# EAGLE design Carrier-Board-CM740 (EAGLE 9.6.2)
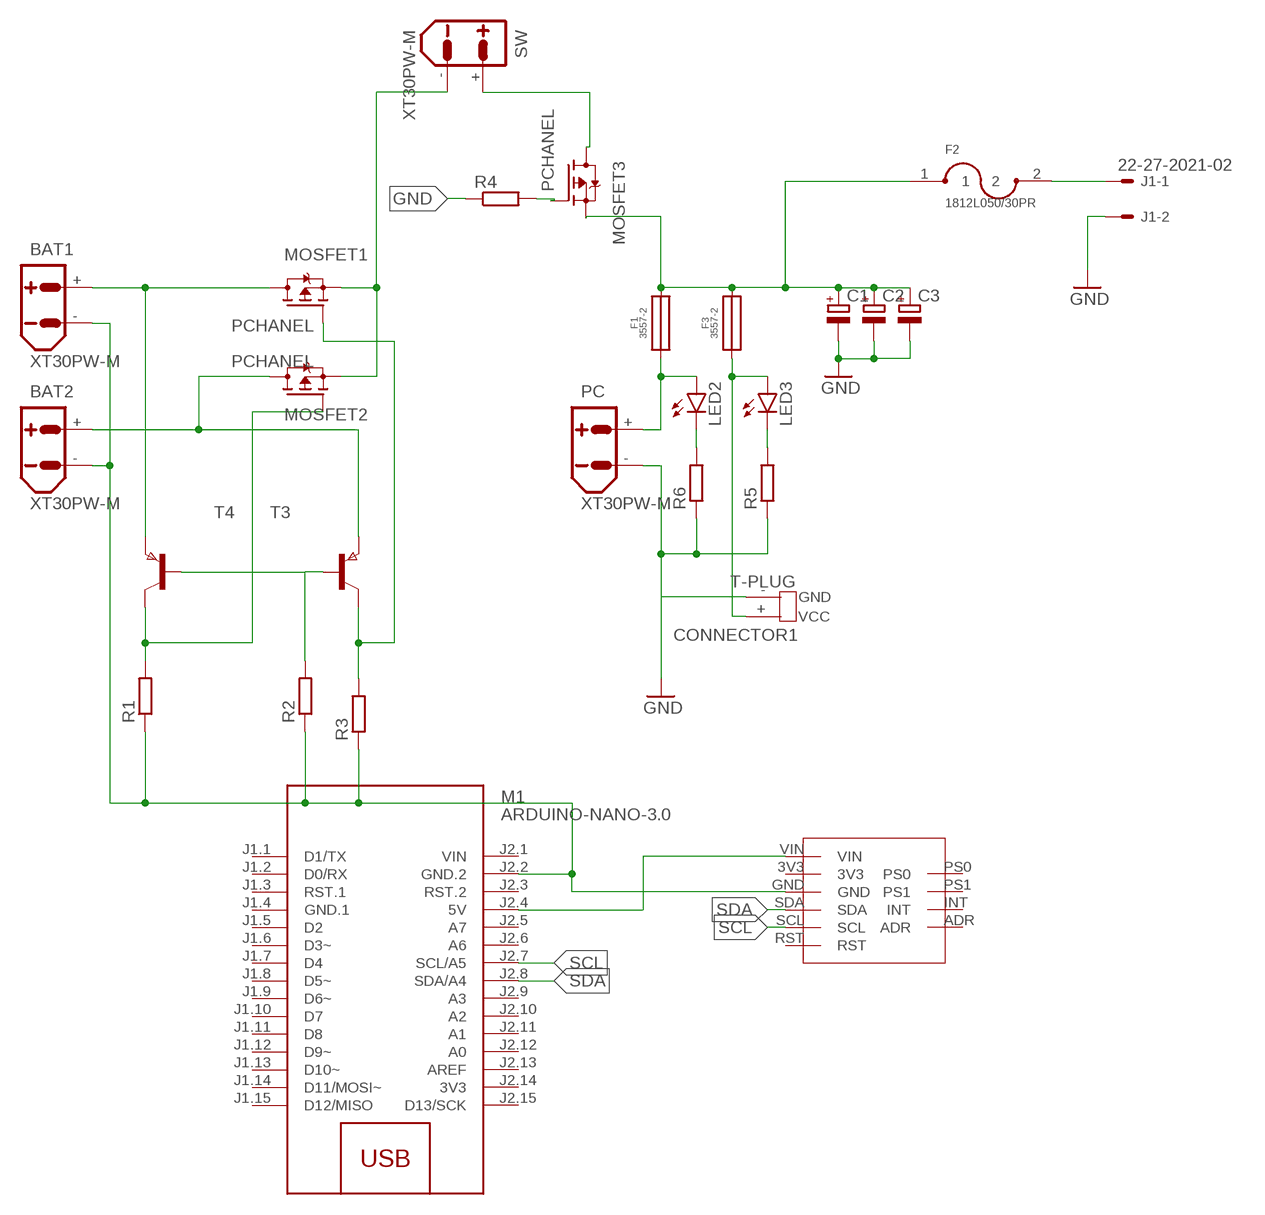
[diagram p0: schematic, sheet 1]

## Parts
BAT1  XT30PW-M  [XT30PW-M]
BAT2  XT30PW-M  [XT30PW-M]
C1  CPOL-EU150CLZ-1014  [150CLZ-1014]
C2  CPOL-EU150CLZ-1014  [150CLZ-1014]
C3  CPOL-EU150CLZ-1014  [150CLZ-1014]
CONNECTOR1  T-PLUG  [T-PLUG]
F1  3557-2  [3557-2]
F2  1812L050/30PR  [FUSM4632X75]
F3  3557-2  [3557-2]
J1  22-27-2021-02  [6410-02]
LED2  LEDCHIP-LED0805  [CHIP-LED0805]
LED3  LEDCHIP-LED0805  [CHIP-LED0805]
M1  ARDUINO-NANO-3.0  [ARDUINO-NANO-3.0]
MOSFET1  PCHANEL  FDD4141TO252  [TO252]
MOSFET2  PCHANEL  FDD4141TO252  [TO252]
MOSFET3  PCHANEL  FDD4141TO252  [TO252]
PC  XT30PW-M  [XT30PW-M]
R1  R-EU_R1206  [R1206]
R2  R-EU_R1206  [R1206]
R3  R-EU_R1206  [R1206]
R4  R-EU_R1206  [R1206]
R5  R-EU_M0805  [M0805]
R6  R-EU_M0805  [M0805]
SW  XT30PW-M  [XT30PW-M]
T3  PNPSOT23  [SOT-23]
T4  PNPSOT23  [SOT-23]
U$1  BNO055_BNO055  [BNO055_BNO055]

## Nets
GND: BAT1.- BAT2.- C1.- C2.- C3.- CONNECTOR1.-(GND) J1.2 M1.J2.2(GND.2) PC.- R1.1 R2.1 R3.1 R4.1 R5.1 R6.1 U$1.GND
N$1: BAT1.+ MOSFET1.3(D) T4.2(E)
N$2: MOSFET2.1(G) R1.2 T4.1(C)
N$3: R2.2 T3.3(B) T4.3(B)
N$4: F2.2 J1.1
N$5: F1.1 F1.2 LED2.A PC.+
N$6: M1.J2.4(5V) U$1.VIN
N$7: MOSFET3.3(D) SW.+
N$8: MOSFET1.2(S) MOSFET2.2(S) SW.-
N$9: MOSFET1.1(G) R3.2 T3.1(C)
N$10: BAT2.+ MOSFET2.3(D) T3.2(E)
N$11: LED2.C R6.2
N$12: C1.+ C2.+ C3.+ F1.3 F1.4 F2.1 F3.3 F3.4 MOSFET3.2(S)
N$13: LED3.C R5.2
N$14: MOSFET3.1(G) R4.2
SCL: M1.J2.7(SCL/A5) U$1.SCL
SDA: M1.J2.8(SDA/A4) U$1.SDA
VCC: CONNECTOR1.+(VCC) F3.1 F3.2 LED3.A
Unconnected: M1.J1.1(D1/TX) M1.J1.2(D0/RX) M1.J1.3(RST.1) M1.J1.5(D2) M1.J1.6(D3~) M1.J1.7(D4) M1.J1.8(D5~) M1.J1.9(D6~) M1.J1.10(D7) M1.J1.11(D8) M1.J1.12(D9~) M1.J1.13(D10~) M1.J1.14(D11/MOSI~) M1.J1.15(D12/MISO) M1.J2.3(RST.2) M1.J2.5(A7) M1.J2.6(A6) M1.J2.9(A3) M1.J2.10(A2) M1.J2.11(A1) M1.J2.12(A0) M1.J2.13(AREF) M1.J2.15(D13/SCK) U$1.3V3 U$1.ADR U$1.INT U$1.PS0 U$1.PS1 U$1.RST

## Power pins joined to a net without a drawn wire
3V3: M1.J2.14(3V3)
GND.1: M1.J1.4(GND.1)
VIN: M1.J2.1(VIN)

## Library data of the parts
BAT1 BAT2 PC SW = amass:XT30: AMASS XT30 connector Store in Japan AMASS XT30 connector <https://szc.jp/ams-xt30>
C1-C3 = resistor12:CPOL-EU: POLARIZED CAPACITOR, European symbol
CONNECTOR1 = T-PLUG:T-PLUG
F1 F3 = 3557-2:3557-2
F2 = 1812L050_30PR:1812L050/30PR: PTC Resettable Fuse 0.5A(hold) 1A(trip) 15VDC 100A 0.8W 0.15s 0.15Ohm SMD Solder Pad 1812 T/R Check availability <https://pricing.snapeda.com/parts/1812L050/30PR/Littelfuse/view-part?ref=eda>; AVAILABILITY: In Stock; CHECK_PRICES: https://www.snapeda.com/parts/1812L050/30PR/Ersa/view-part/?ref=eda; DESCRIPTION: Fuse, Resettable, 1812 Series, PPTC 30V, 500mA, Surface Mount | Littelfuse 1812L050/30PR; MF: Littelfuse; MP: 1812L050/30PR; PACKAGE: None; PRICE: None; PURCHASE-URL: https://www.snapeda.com/api/url_track_click_mouser/?unipart_id=12295976&manufacturer=Littelfuse&part_name=1812L050/30PR&search_term=fuse pptc; SNAPEDA_LINK: https://www.snapeda.com/parts/1812L050/30PR/Ersa/view-part/?ref=snap
J1 = con-molex:22-?-02: CONNECTOR wire to board 2.54 mm (.1 inch) pitch header; MF: MOLEX; OC_FARNELL: unknown; OC_NEWARK: unknown
LED2 LED3 = led:LED: LED OSRAM: - CHIPLED LG R971, LG N971, LY N971, LG Q971, LY Q971, LO R971, LY R971 LH N974, LH R974 LS Q976, LO Q976, LY Q976 LO Q996 - Hyper CHIPLED LW Q18S LB Q993, LB Q99A, LB R99A - SideLED LS A670, LO A670, LY A670, LG A670, LP A670 LB A673, LV A673, LT A673, LW A673 LH A674 LY A675 LS A676, LA A676, LO A676, LY A676, LW A676 LS A679, LY A679, LG A679 - Hyper Micro SIDELED® LS Y876, LA Y876, LO Y876, LY Y876 LT Y87S - SmartLED LW L88C, LW L88S LB L89C, LB L89S, LG L890 LS L89K, LO L89K, LY L89K LS L896, LA L896, LO L896, LY L896 - TOPLED LS T670, LO T670, LY T670, LG T670, LP T670 LSG T670, LSP T670, LSY T670, LOP T670, LYG T670 LG T671, LOG T671, LSG T671 LB T673, LV T673, LT T673, LW T673 LH T674 LS T676, LA T676, LO T676, LY T676, LB T676, LH T676, LSB T676, LW T676 LB T67C, LV T67C, LT T67C, LS T67K, LO T67K, LY T67K, LW E67C LS E67B, LA E67B, LO E67B, LY E67B, LB E67C, LV E67C, LT E67C LW T67C LS T679, LY T679, LG T679 LS T770, LO T770, LY T770, LG T770, LP T770 LB T773, LV T773, LT T773, LW T773 LH T774 LS E675, LA E675, LY E675, LS T675 LS T776, LA T776, LO T776, LY T776, LB T776 LHGB T686 LT T68C, LB T68C - Hyper Mini TOPLED® LB M676 - Mini TOPLED Santana® LG M470 LS M47K, LO M47K, LY M47K Source: http://www.osram.convergy.de LUXEON: - LUMILED® LXK2-PW12-R00, LXK2-PW12-S00, LXK2-PW14-U00, LXK2-PW14-V00 LXK2-PM12-R00, LXK2-PM12-S00, LXK2-PM14-U00 LXK2-PE12-Q00, LXK2-PE12-R00, LXK2-PE12-S00, LXK2-PE14-T00, LXK2-PE14-U00 LXK2-PB12-K00, LXK2-PB12-L00, LXK2-PB12-M00, LXK2-PB14-N00, LXK2-PB14-P00, LXK2-PB14-Q00 LXK2-PR12-L00, LXK2-PR12-M00, LXK2-PR14-Q00, LXK2-PR14-R00 LXK2-PD12-Q00, LXK2-PD12-R00, LXK2-PD12-S00 LXK2-PH12-R00, LXK2-PH12-S00 LXK2-PL12-P00, LXK2-PL12-Q00, LXK2-PL12-R00 Source: www.luxeon.com KINGBRIGHT: KA-3528ASYC Source: www.kingbright.com
M1 = diy-modules:ARDUINO-NANO-3.0: Arduino Nano 3.0 and compatible devices More details available here: https://www.arduino.cc/en/Main/ArduinoBoardNano Click here to find device on ebay.com <http://www.ebay.com/sch/arduino+nano>
MOSFET1-MOSFET3 = transistor-fet:FDD4141: P-Channel PowerTrench® MOSFET Source: FDD4141.pdf
R1-R6 = rcl:R-EU_: RESISTOR, European symbol; SPICEPREFIX: R
T3 T4 = zetex:PNPSOT23: PNP TRANSISTOR; MPN: DSS20200L-7; OC_FARNELL: unknown; OC_NEWARK: 25R4554
U$1 = CM FT4232 with RS485 and ESP32:BNO055_BNO055

## Board
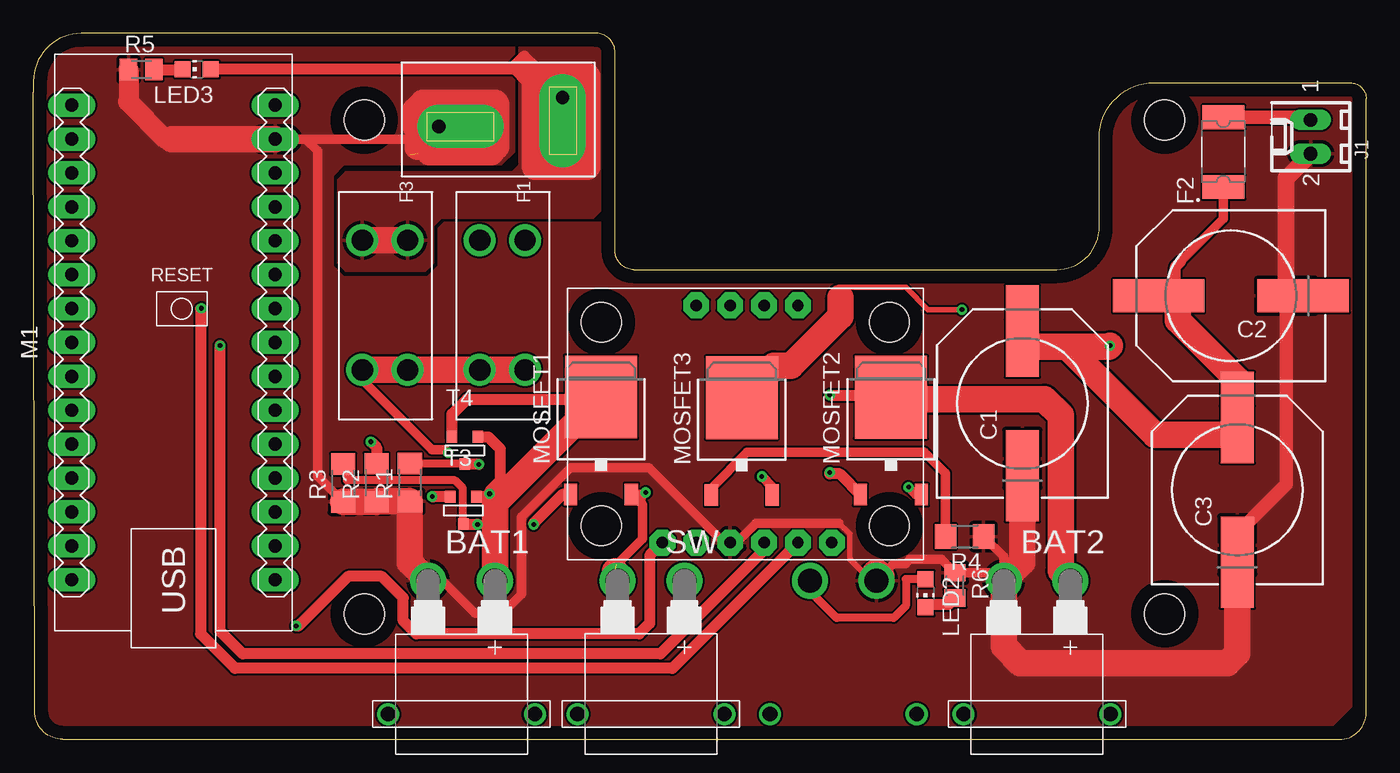
[diagram p1: board, top side]
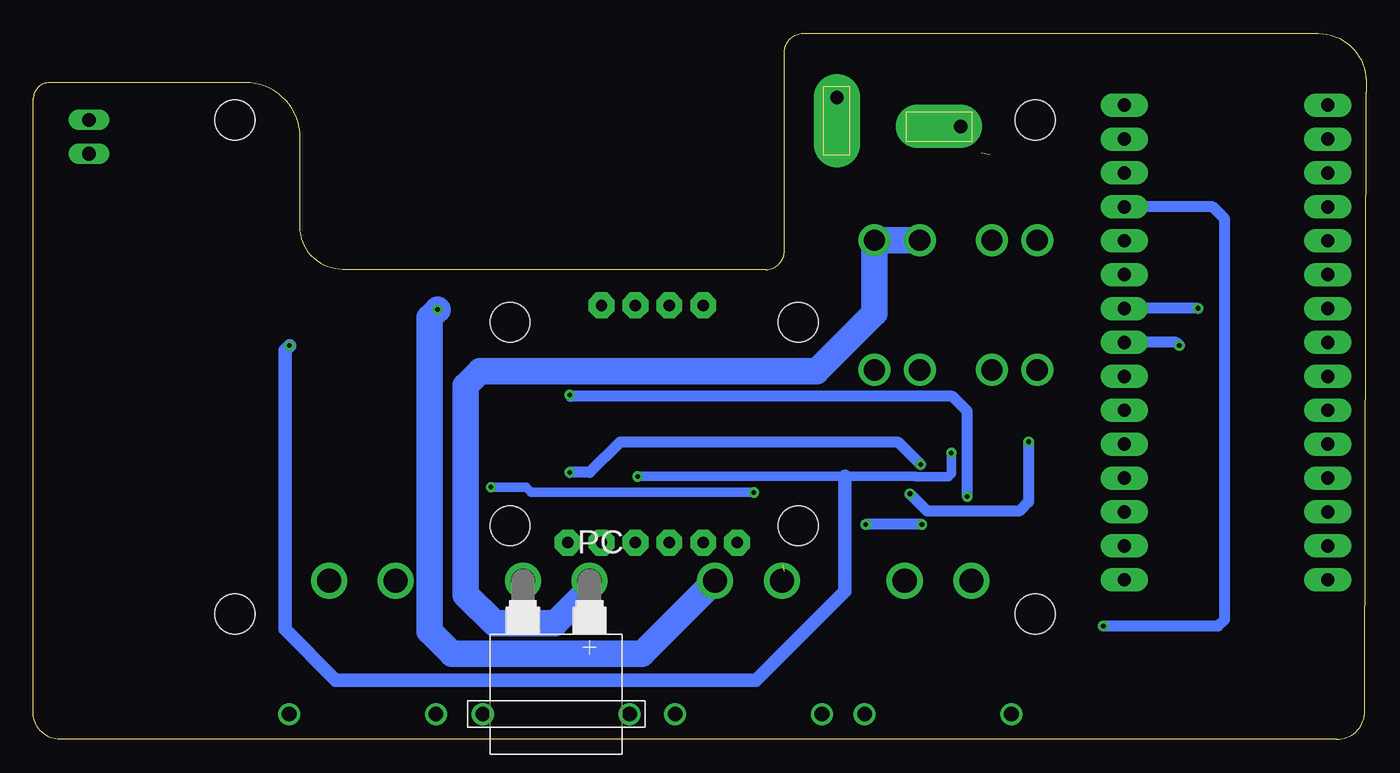
[diagram p2: board, bottom side, seen from below]

Size 99.9 x 52.9 mm. Coordinates in mm from the lower left corner, seen from the top.
Outline: 2.2,0 97.9,0 arc90 99.9,2 99.9,48 arc90 98.7,49.2 84,49.2 arc90 79.9,45.1 79.9,38.4 arc-90 76.7,35.2 45,35.2 arc-90 43.6,36.6 43.6,51.5 arc90 42.2,52.9 3.6,52.9 arc90 0,49.3 0,48.5 0.1,2.3 0.1,2.1 arc90 2.2,0
Outline: 29.5,47 34.5,47 34.5,44.8 29.5,44.8 29.5,47
Outline: 38.7,48.9 40.7,48.9 40.7,43.8 38.7,43.8 38.7,48.9
Copper layers (1*16): Top 0.035mm / dielectric 1.5mm / Bottom 0.035mm
Design rules "default": minimum track width 6mil, minimum drill 0.35mm, track to track 6mil, track to pad 6mil, pad to pad 6mil, via to via 6mil, smd to smd 6mil, copper to edge 40mil, drill to drill 6mil, minimum pad ring 10mil, minimum via ring 8mil, stop-mask expansion 4mil, vias tented up to drill 0mil, thermal gap 10mil
Holes 3 mm at 24.8,9.4 84.8,9.4 24.8,46.4 84.8,46.4
Milling: 8 lines

### Footprints (pad centres in the part's own frame; a part is rotated, then mirrored left to right if it is on the bottom)
XT30PW-M = drill 1.8: + -2.5,0; - 2.5,0 | drill 1.1: P$3 -5.5,10; P$4 5.5,10
150CLZ-1014 = smd 4.3 x 2.5: + 4.15,0; +1 6.69,0; - -4.15,0; -1 -4.15,0; -2 -6.69,0
T-PLUG = drill 1 pad 3.5 offset: + 3.9,0.43 | drill 1 pad 3.25 offset: - 1.73,9.7
3557-2 = drill 1.6: 1 3.603,5.154; 2 3.603,1.754; 3 13.311,5.154; 4 13.311,1.754
FUSM4632X75 = smd 1.78 x 3.15: 1 -2.615,0; 2 2.615,0
6410-02 = drill 1.016 long: 1 1.27,0; 2 -1.27,0
CHIP-LED0805 = smd 1.2 x 1.2: A 0,-1.05; C 0,1.05
ARDUINO-NANO-3.0 = drill 1 pad 1.778 long: J1.1 17.78,7.62; J1.2 15.24,7.62; J1.3 12.7,7.62; J1.4 10.16,7.62; J1.5 7.62,7.62; J1.6 5.08,7.62; J1.7 2.54,7.62; J1.8 0,7.62; J1.9 -2.54,7.62; J1.10 -5.08,7.62; J1.11 -7.62,7.62; J1.12 -10.16,7.62; J1.13 -12.7,7.62; J1.14 -15.24,7.62; J1.15 -17.78,7.62; J2.1 17.78,-7.62; J2.2 15.24,-7.62; J2.3 12.7,-7.62; J2.4 10.16,-7.62; J2.5 7.62,-7.62; J2.6 5.08,-7.62; J2.7 2.54,-7.62; J2.8 0,-7.62; J2.9 -2.54,-7.62; J2.10 -5.08,-7.62; J2.11 -7.62,-7.62; J2.12 -10.16,-7.62; J2.13 -12.7,-7.62; J2.14 -15.24,-7.62; J2.15 -17.78,-7.62
TO252 = smd 1 x 1.6: 1 -2.28,-4.8; 2 2.28,-4.8 | smd 5.4 x 6.2: 3 0,2.5
R1206 = smd 1.6 x 1.803: 1 -1.422,0; 2 1.422,0
M0805 = smd 1.3 x 1.6: 1 -0.95,0; 2 0.95,0
SOT-23 = smd 0.787 x 0.889: 1 0.025,-1.016; 2 -0.94,1.016; 3 0.991,1.016
BNO055_BNO055 = drill 0.85 pad 1.93 octagon: 3V3 9.652,1.27; ADR 17.272,19.05; GND 12.192,1.27; INT 14.732,19.05; PS0 9.652,19.05; PS1 12.192,19.05; RST 19.812,1.27; SCL 17.272,1.27; SDA 14.732,1.27; VIN 7.112,1.27 | hole 3: 2.54,2.54; 2.54,17.78; 24.13,2.54; 24.13,17.78

### Placement (x,y rotation side)
BAT1  32.09,11.89 180 top
BAT2  75.23,11.89 180 top
C1  74.13,25.17 90 top
C2  89.76,33.24 180 top
C3  90.24,18.69 90 top
CONNECTOR1  40.1,44.2 90 top
F1  31.7,41 270 top
F2  89.2,44 90 top
F3  22.9,41 270 top
J1  95.74,45.15 90 top
LED2  66.88,10.95 180 top
LED3  12.25,50.2 90 top
M1  10.5,29.74 90 top
MOSFET1  42.55,23.16 0 top
MOSFET2  64.28,23.14 0 top
MOSFET3  53.1,23.1 0 top
PC  60.71,11.89 180 bottom
R1  28.22,19.25 90 top
R2  25.72,19.23 90 top
R3  23.22,19.21 90 top
R4  69.8,15.2 180 top
R5  8.09,50.18 0 top
R6  69.08,11.53 270 top
SW  46.29,11.9 180 top
T3  32.2,17.15 0 top
T4  32.31,21.65 0 top
U$1  40.04,13.47 0 top

### Tracks (layer width: path | path; a pad name or v marks a point on that pad's centre or on a via)
GND  (1 unrouted)
  Top 0.152: 18.14,45 M1.J2.2 | 29.11,43.71 29.05,43.71 28.83,43.93 | 28.8,44.4 28.2,43.8
  Top 0.4: 60.4,16.21 61.2,15.41 61.2,13.5 62.81,11.89 PC.-
  Top 0.7: R4.1 72.73,13.69 BAT2.- 72.14,12.48 R6.1 68.06,13.5 65.71,13.5 65.36,13.14 64.46,13.14 63.56,12.24 | 60.4,16.21 54.16,16.21 52.7,14.74 U$1.GND 51.77,14.74 46.15,20.36 40.26,20.36 36.59,16.69 36.59,10.87 35.16,9.44 33.12,9.44 30.67,11.89 BAT1.- | R3.1 21.3,19.71 21.3,44.1 20.42,44.98 | M1.J2.2 20.42,44.98 | 29.3,44.4 28.72,44.98 20.42,44.98
  Top 1: C2.- 93.91,19.11 90.24,15.44 90.24,12.4
  Top 1.27: C2.- 93.91,42.05 J1.2
  Top 1.5: R5.1 7.14,47.84 7.1,47.8 9.92,44.98 13.3,44.98
  Top 2: 10.39,44.98 13.3,44.98 M1.J2.2 | CONNECTOR1.- 28.67,45.93 28.6,46 28.6,47.1 29.2,47.7 34.6,47.7 34.7,47.6 34.7,44.4 34.3,44 29.7,44 29.3,44.4 28.8,44.4 | C1.- 74.13,13.29 BAT2.- 72.73,6.97 74,5.7 89.5,5.7 90.24,6.44 90.24,12.4 C3.- | BAT1.- 28.22,13.26 R1.1 25.74,17.83 R2.1 25.7,17.79 R3.1 | PC.- 63.21,12.38 63.1,12.49 63.31,12.49 63.56,12.24
  pour Top: 36.1,52.5 36.1,44 35.1,43 23.3,43 22.5,42.2 22.5,35.5 23.3,34.7 29.5,34.7 30.3,35.5 30.3,38.3 30.8,38.8 42.7,38.8 43.2,38.3 43.2,36.1 44.4,34.9 78.5,34.9 80.6,37 80.6,46.3 80.5,46.4 82.8,48.7 98.5,48.7 99.6,47.6 99.6,3.2 96.5,0.1 2.2,0.1 0,2.3 0,49.8 3,52.8 35.8,52.8
N$1
  Top 0.813: T4.2 31.37,24.37 32.5,25.5 42.55,25.5 MOSFET1.3
  Top 2: BAT1.+ 34.59,17.69 MOSFET1.3
N$2  (via drill 0.35)
  Top 0.61: T4.1 28.26,20.63 R1.2
  Top 0.813: T4.1 33.37,20.63 v33.4,20.6 | 61.9,18.44 MOSFET2.1 60.44,19.9 59.7,19.9 v59.7,20
  Bottom 0.813: v59.7,20 58.2,20 55.9,22.3 35.1,22.3 v33.4,20.6
N$3  (via drill 0.35)
  Top 0.813: T4.3 34.1,22.67 35,21.77 35,19.38 34.2,18.57 v34.2,18.4 34.2,18.38 33.99,18.17 T3.3 | v25.3,22.3 25.72,21.88 R2.2
  Bottom 0.813: v25.3,22.3 25.3,17.8 26,17.1 32.9,17.1 v34.2,18.4
N$4
  Top 1: F2.2 95.54,46.62 J1.1
N$5
  Top 0.61: LED2.A 65.4,12 65.4,10 64.5,9.1 60.2,9.1 58.21,11.09 PC.+
  Bottom 2: F1.2 F1.1 36.85,31.95 41.2,27.6 66.4,27.6 67.49,26.51 67.49,10.83 65.35,8.69 60.81,8.69 58.21,11.29 PC.+
N$6  (via drill 0.35)
  Top 0.813: U$1.VIN 46.2,13.79 46.2,8.7 45.4,7.9 28.7,7.9 27.72,8.88 27.72,10.61 26.11,12.22 23.59,12.22 19.87,8.5 v19.7,8.5
  Bottom 0.813: v19.7,8.5 11.1,8.5 10.6,9 10.6,39 11.5,39.9 M1.J2.4
N$7  (via drill 0.35)
  Top 0.4: v69.6,32.2 67.06,32.2 65.39,33.87 60.6,33.87 60.6,33.2 60.5,33.1
  Top 2: MOSFET3.3 55.5,28 56.8,28 60.5,31.7 60.5,33.1
  Bottom 2: SW.+ 54.29,6.4 68.5,6.4 70.2,8.1 70.2,31.6 v69.6,32.2
N$8  (via drill 0.35)  (1 unrouted)
  Top 0.7: 45.55,18 45.18,18.36 MOSFET1.2 | MOSFET1.2 44.88,18.36 45.65,17.6 45.65,15.05 43.7,13.1 | MOSFET1.2 45.76,18.36 v45.9,18.5 | v65.6,18.9 66.16,18.34 MOSFET2.2
  Top 2: SW.- 43.6,12.09 43.6,12.6
  Bottom 0.7: v45.9,18.5 62.61,18.5 62.98,18.88 65.38,18.88 65.4,18.9 v65.6,18.9
N$9  (via drill 0.35)
  Top 0.61: T3.1 32.2,16.16 32.2,18.8 31.6,19.4 23.5,19.4 23.5,20.35 R3.2
  Top 0.813: T3.1 33.27,16.13 v33.3,16.1 | v37.5,16.1 37.5,16.2 39.66,18.36 MOSFET1.1
  Bottom 0.813: v33.3,16.1 v37.5,16.1
N$10  (via drill 0.35)
  Top 0.813: T3.2 29.93,18.17 v29.9,18.2 | v59.7,25.8 64.12,25.8 MOSFET2.3
  Top 2: MOSFET2.3 64.42,25.5 75.8,25.5 77,24.3 77,12.62 BAT2.+
  Bottom 0.813: v29.9,18.2 29.9,24.6 31,25.7 59.6,25.7 v59.7,25.8
N$11
  Top 0.813: R6.2 68.6,10.1 67.08,10.1 LED2.C
N$12  (via drill 0.35)
  Top 0.7: 85.98,35.8 89.2,39.02 F2.1 | MOSFET3.2 55.38,18.92 v54.6,19.7 | v31.1,21.47 30.85,21.72 29.88,21.72 24.65,26.95 F3.4 24.65,27.05
  Top 0.813: C2.+ 85.61,35.43 85.98,35.8
  Top 2: F1.3 F1.4 F3.3 F3.4 | C1.+ 74.23,29.42 77.48,29.42 | 77.48,29.42 84.06,22.84 C3.+ 90.24,26.96 85.8,31.4 85.8,33.05 C2.+ | v80.7,29.5 80.62,29.42 77.48,29.42
  Bottom 0.7: v54.6,19.7 39.06,19.7 33.78,19.7 33.78,19.69 31.31,19.69 31.1,19.9 v31.1,21.47
  Bottom 1: v80.7,29.5 81.04,29.16 81.04,8.24 77.23,4.44 45.72,4.44 39.06,11.09 39.06,19.7
N$13
  Top 0.813: R5.2 11.18,50.18 LED3.C
N$14
  Top 0.7: MOSFET3.1 50.82,18.82 53.5,21.5 66.8,21.5 68.38,19.92 R4.2
SCL  (via drill 0.35)
  Top 0.813: U$1.SCL 47.89,5.32 15.11,5.32 12.54,7.9 12.54,32.23 v12.6,32.3
  Bottom 0.813: v12.6,32.3 18.1,32.3 M1.J2.7
SDA  (via drill 0.35)
  Top 0.813: U$1.SDA 54.57,14.54 54.57,13.97 47,6.4 15.7,6.4 14,8.1 v14,29.5
  Bottom 0.813: v14,29.5 14.24,29.74 M1.J2.8
VCC
  Top 0.813: CONNECTOR1.+ 37.57,50.2 36.1,50.2 | 36.1,50.2 LED3.A | 36.1,50.2 36.9,49.4 37.75,50.25 36.8,51.2 36.1,50.5 36.1,50.2
  Top 2: F3.2 F3.1 | CONNECTOR1.+ 39.67,49.7 | 39.67,49.7 41.5,49.7 41.5,42.9 37.6,42.9 37.6,49.7 39.67,49.7
  pour Top: 36.4,52.8 36.4,43 35.9,42.5 23.4,42.5 22.8,41.9 22.8,35.7 23.4,35.1 29.4,35.1 30,35.7 30,38.5 30.3,38.8 30.6,39.1 42,39.1 43.1,40.2 43.1,40.3 43.1,52.1 42.4,52.8